# EAGLE design Groupe7 (EAGLE 9.6.2)
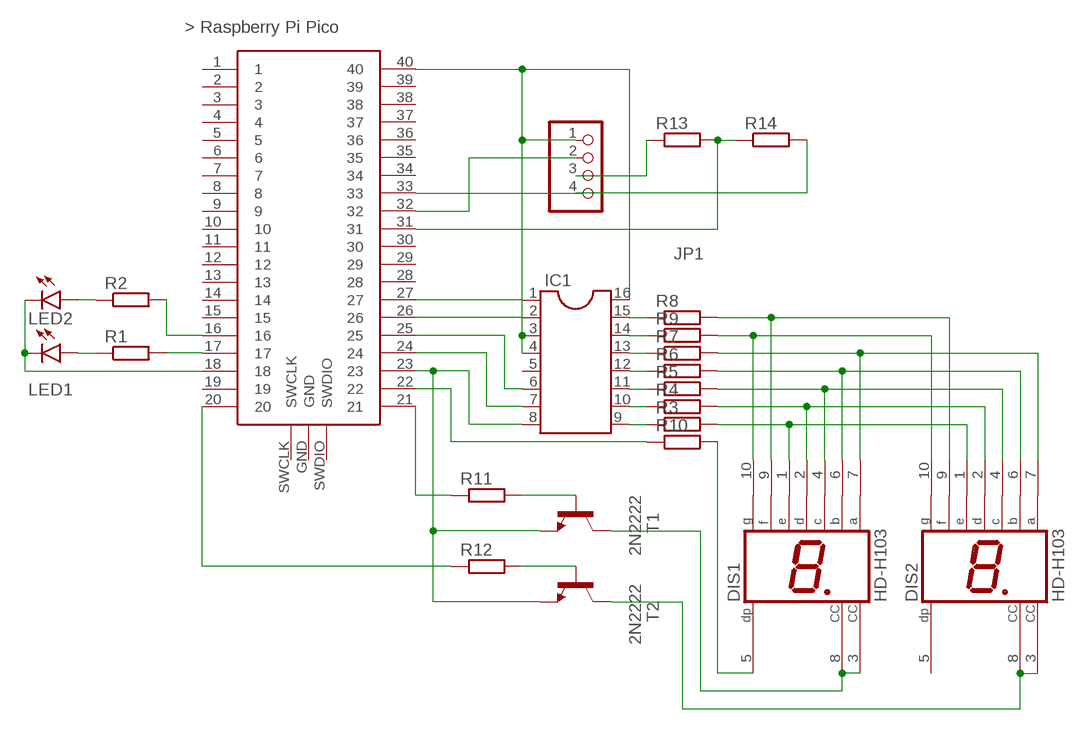
[diagram p0: schematic, sheet 1]

## Parts
DIS1  HD-H103  [HDSP-M]
DIS2  HD-H103  [HDSP-M]
IC1  DIL16  [DIL16]
JP1  PINHD-1X4  [1X04]
LED1  LED5MM  [LED5MM]
LED2  LED5MM  [LED5MM]
R1  R-EU_0207/7  [0207/7]
R2  R-EU_0207/7  [0207/7]
R3  R-EU_0207/7  [0207/7]
R4  R-EU_0207/7  [0207/7]
R5  R-EU_0207/7  [0207/7]
R6  R-EU_0207/7  [0207/7]
R7  R-EU_0207/7  [0207/7]
R8  R-EU_0207/7  [0207/7]
R9  R-EU_0207/7  [0207/7]
R10  R-EU_0207/7  [0207/7]
R11  R-EU_0207/7  [0207/7]
R12  R-EU_0207/7  [0207/7]
R13  R-EU_0207/7  [0207/7]
R14  R-EU_0207/7  [0207/7]
T1  2N2222  [TO18]
T2  2N2222  [TO18]
U$1  RASPBERRY-PI-PICO_TH  [FT_RASPBERRY-PI-PICO_TH]

## Nets
N$1: IC1.15 R8.1
N$2: IC1.14 R9.1
N$3: IC1.13 R7.1
N$4: IC1.12 R6.1
N$5: IC1.11 R5.1
N$6: IC1.10 R4.1
N$7: IC1.9 R3.1
N$8: IC1.1 U$1.27
N$9: IC1.2 U$1.26
N$10: IC1.6 U$1.25
N$11: IC1.7 U$1.24
N$12: DIS1.9(F) DIS2.9(F) R8.2
N$13: DIS1.10(G) DIS2.10(G) R9.2
N$14: DIS1.7(A) DIS2.7(A) R7.2
N$15: DIS1.6(B) DIS2.6(B) R6.2
N$16: DIS1.4(C) DIS2.4(C) R5.2
N$17: DIS1.2(D) DIS2.2(D) R4.2
N$18: DIS1.1(E) DIS2.1(E) R3.2
N$19: IC1.3 IC1.4 IC1.16 JP1.1 U$1.40
N$20: IC1.8 T1.1(E) T2.1(E) U$1.23
N$21: JP1.2 U$1.32
N$22: JP1.3 R13.1
N$23: JP1.4 R14.2 U$1.33
N$24: DIS1.3(CC) DIS1.8(CC) T1.3(C)
N$25: DIS2.3(CC) DIS2.8(CC) T2.3(C)
N$26: DIS1.5(DP) R10.2
N$27: R10.1 U$1.22
N$28: R12.1 U$1.20
N$29: R1.2 U$1.17
N$30: R11.1 U$1.21
N$31: R2.2 U$1.16
N$32: LED2.A R2.1
N$33: LED1.A R1.1
N$34: LED1.K(C) LED2.K(C) U$1.18
N$35: R11.2 T1.2(B)
N$36: R12.2 T2.2(B)
N$37: R13.2 R14.1 U$1.31
Unconnected: DIS2.5(DP) IC1.5 U$1.1 U$1.2 U$1.3 U$1.4 U$1.5 U$1.6 U$1.7 U$1.8 U$1.9 U$1.10 U$1.11 U$1.12 U$1.13 U$1.14 U$1.15 U$1.19 U$1.28 U$1.29 U$1.30 U$1.34 U$1.35 U$1.36 U$1.37 U$1.38 U$1.39 U$1.GND U$1.SWCLK U$1.SWDIO

## Library data of the parts
DIS1 DIS2 = display-hp:HD-H103: LED DISPLAY 1-character 7 segment, decimal point right; OC_FARNELL: unknown; OC_NEWARK: unknown
IC1 = ic-package:DIL16: Dual In Line / Socket
JP1 = pinhead:PINHD-1X4: PIN HEADER
LED1 LED2 = led:LED: LED OSRAM: - CHIPLED LG R971, LG N971, LY N971, LG Q971, LY Q971, LO R971, LY R971 LH N974, LH R974 LS Q976, LO Q976, LY Q976 LO Q996 - Hyper CHIPLED LW Q18S LB Q993, LB Q99A, LB R99A - SideLED LS A670, LO A670, LY A670, LG A670, LP A670 LB A673, LV A673, LT A673, LW A673 LH A674 LY A675 LS A676, LA A676, LO A676, LY A676, LW A676 LS A679, LY A679, LG A679 - Hyper Micro SIDELED® LS Y876, LA Y876, LO Y876, LY Y876 LT Y87S - SmartLED LW L88C, LW L88S LB L89C, LB L89S, LG L890 LS L89K, LO L89K, LY L89K LS L896, LA L896, LO L896, LY L896 - TOPLED LS T670, LO T670, LY T670, LG T670, LP T670 LSG T670, LSP T670, LSY T670, LOP T670, LYG T670 LG T671, LOG T671, LSG T671 LB T673, LV T673, LT T673, LW T673 LH T674 LS T676, LA T676, LO T676, LY T676, LB T676, LH T676, LSB T676, LW T676 LB T67C, LV T67C, LT T67C, LS T67K, LO T67K, LY T67K, LW E67C LS E67B, LA E67B, LO E67B, LY E67B, LB E67C, LV E67C, LT E67C LW T67C LS T679, LY T679, LG T679 LS T770, LO T770, LY T770, LG T770, LP T770 LB T773, LV T773, LT T773, LW T773 LH T774 LS E675, LA E675, LY E675, LS T675 LS T776, LA T776, LO T776, LY T776, LB T776 LHGB T686 LT T68C, LB T68C - Hyper Mini TOPLED® LB M676 - Mini TOPLED Santana® LG M470 LS M47K, LO M47K, LY M47K Source: http://www.osram.convergy.de LUXEON: - LUMILED® LXK2-PW12-R00, LXK2-PW12-S00, LXK2-PW14-U00, LXK2-PW14-V00 LXK2-PM12-R00, LXK2-PM12-S00, LXK2-PM14-U00 LXK2-PE12-Q00, LXK2-PE12-R00, LXK2-PE12-S00, LXK2-PE14-T00, LXK2-PE14-U00 LXK2-PB12-K00, LXK2-PB12-L00, LXK2-PB12-M00, LXK2-PB14-N00, LXK2-PB14-P00, LXK2-PB14-Q00 LXK2-PR12-L00, LXK2-PR12-M00, LXK2-PR14-Q00, LXK2-PR14-R00 LXK2-PD12-Q00, LXK2-PD12-R00, LXK2-PD12-S00 LXK2-PH12-R00, LXK2-PH12-S00 LXK2-PL12-P00, LXK2-PL12-Q00, LXK2-PL12-R00 Source: www.luxeon.com KINGBRIGHT: KA-3528ASYC Source: www.kingbright.com
R1-R14 = rcl:R-EU_: RESISTOR, European symbol; SPICEPREFIX: R
T1 T2 = transistor:2N2222: NPN TRANSISTOR
U$1 = pipico:RASPBERRY-PI-PICO_TH: Raspberry Pi Pico microcontroller board for through-hole mounting.

## Board
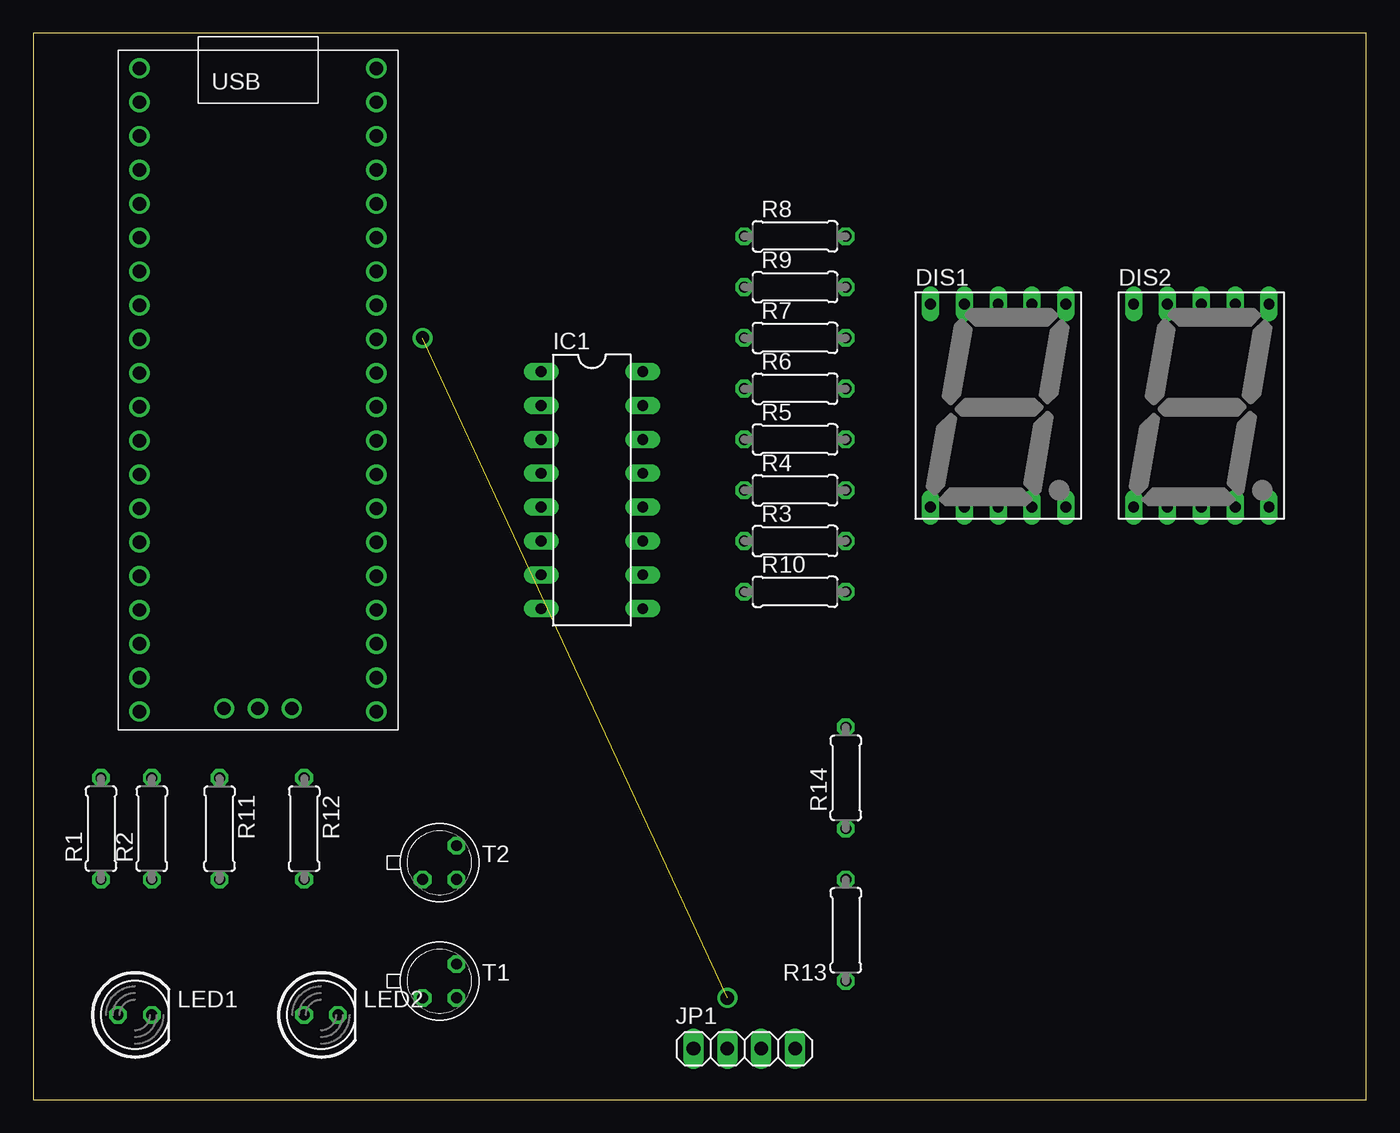
[diagram p1: board, top side]
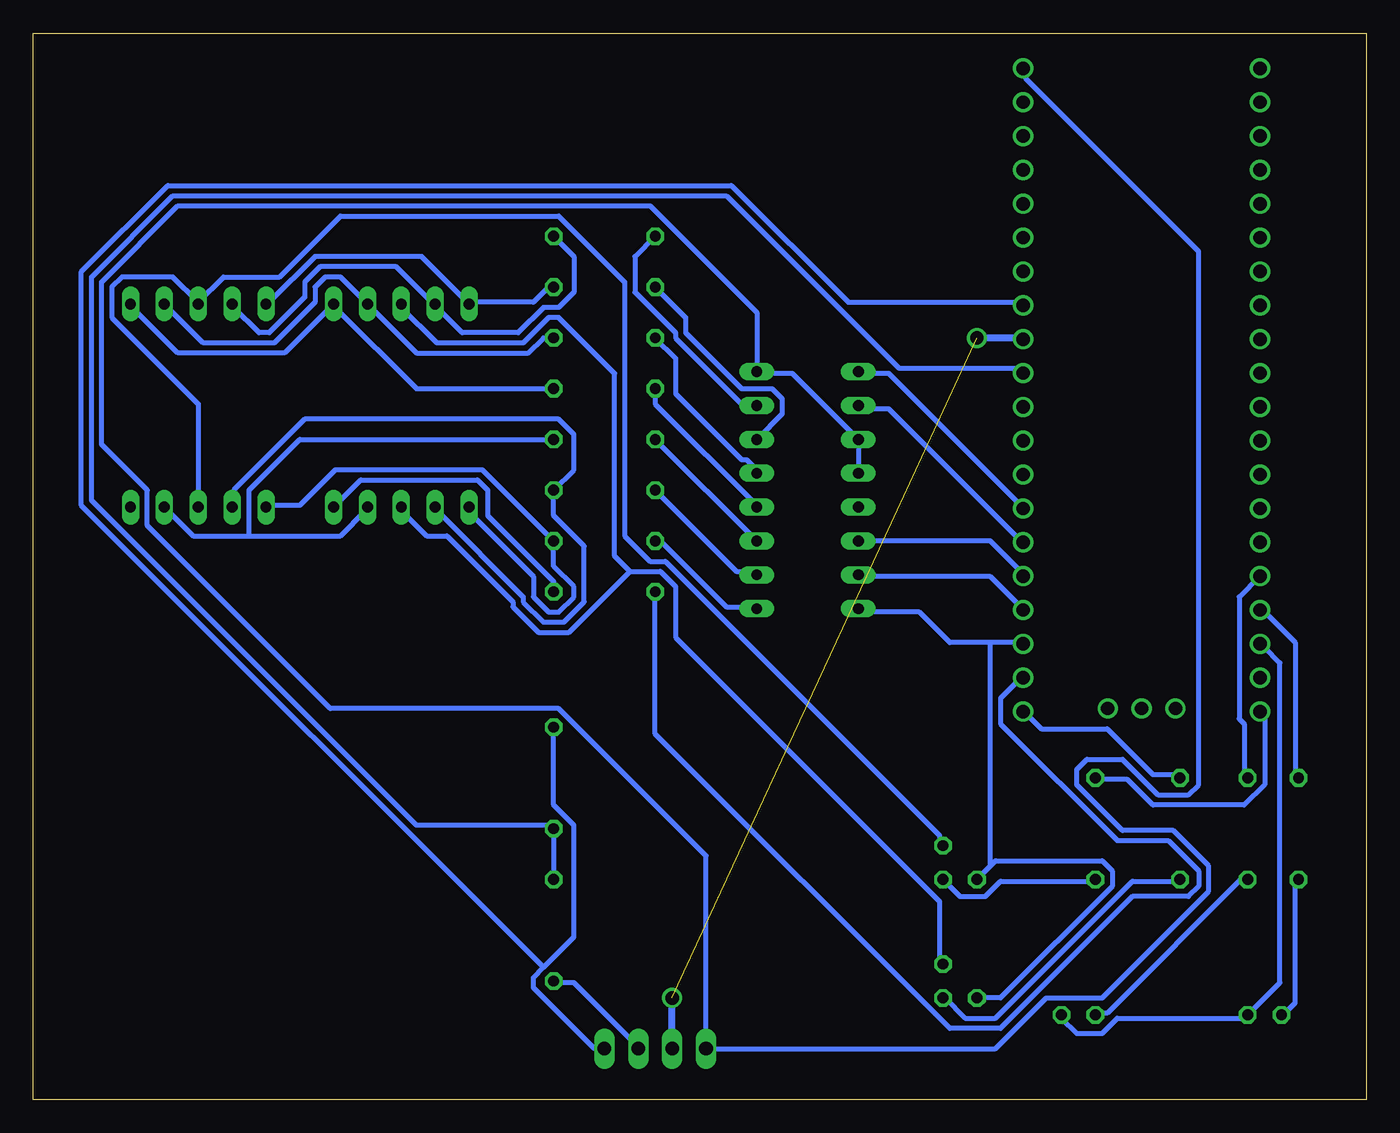
[diagram p2: board, bottom side, seen from below]

Size 100 x 80 mm. Coordinates in mm from the lower left corner, seen from the top.
Outline: 0,0 100,0 100,80 0,80 0,0
Copper layers (1*16): Top 0.035mm / dielectric 1.5mm / Bottom 0.035mm
Design rules "default *": minimum track width 15mil, minimum drill 0.35mm, track to track 15mil, track to pad 15mil, pad to pad 15mil, via to via 15mil, smd to smd 15mil, copper to edge 40mil, drill to drill 6mil, minimum pad ring 10mil, minimum via ring 8mil, stop-mask expansion 4mil, vias tented up to drill 0mil, thermal gap 10mil

### Footprints (pad centres in the part's own frame; a part is rotated, then mirrored left to right if it is on the bottom)
HDSP-M = drill 0.813 long: 1 -5.08,-7.62; 2 -2.54,-7.62; 3 0,-7.62; 4 2.54,-7.62; 5 5.08,-7.62; 6 5.08,7.62; 7 2.54,7.62; 8 0,7.62; 9 -2.54,7.62; 10 -5.08,7.62
DIL16 = drill 0.813 long: 1 -8.89,-3.81; 2 -6.35,-3.81; 3 -3.81,-3.81; 4 -1.27,-3.81; 5 1.27,-3.81; 6 3.81,-3.81; 7 6.35,-3.81; 8 8.89,-3.81; 9 8.89,3.81; 10 6.35,3.81; 11 3.81,3.81; 12 1.27,3.81; 13 -1.27,3.81; 14 -3.81,3.81; 15 -6.35,3.81; 16 -8.89,3.81
1X04 = drill 1.016 long: 1 -3.81,0; 2 -1.27,0; 3 1.27,0; 4 3.81,0
LED5MM = drill 0.813 octagon: A -1.27,0; K 1.27,0
0207/7 = drill 0.813 octagon: 1 -3.81,0; 2 3.81,0
TO18 = drill 0.813 octagon: 1 -1.27,-1.27; 2 1.27,-1.27; 3 1.27,1.27
FT_RASPBERRY-PI-PICO_TH = drill 1: 1 -8.55,24.03; 2 -8.55,21.49; 3 -8.55,18.95; 4 -8.55,16.41; 5 -8.55,13.87; 6 -8.55,11.33; 7 -8.55,8.79; 8 -8.55,6.25; 9 -8.55,3.71; 10 -8.55,1.17; 11 -8.55,-1.37; 12 -8.55,-3.91; 13 -8.55,-6.45; 14 -8.55,-8.99; 15 -8.55,-11.53; 16 -8.55,-14.07; 17 -8.55,-16.61; 18 -8.55,-19.15; 19 -8.55,-21.69; 20 -8.55,-24.23; 21 9.23,-24.23; 22 9.23,-21.69; 23 9.23,-19.15; 24 9.23,-16.61; 25 9.23,-14.07; 26 9.23,-11.53; 27 9.23,-8.99; 28 9.23,-6.45; 29 9.23,-3.91; 30 9.23,-1.37; 31 9.23,1.17; 32 9.23,3.71; 33 9.23,6.25; 34 9.23,8.79; 35 9.23,11.33; 36 9.23,13.87; 37 9.23,16.41; 38 9.23,18.95; 39 9.23,21.49; 40 9.23,24.03; GND 0.34,-24; SWCLK -2.2,-24; SWDIO 2.88,-24

### Placement (x,y rotation side)
DIS1  72.39,52.07 0 top
DIS2  87.63,52.07 0 top
IC1  41.91,45.72 270 top
JP1  53.34,3.81 0 top
LED1  7.62,6.35 0 top
LED2  21.59,6.35 0 top
R1  5.08,20.32 90 top
R2  8.89,20.32 90 top
R3  57.15,41.91 0 top
R4  57.15,45.72 0 top
R5  57.15,49.53 0 top
R6  57.15,53.34 0 top
R7  57.15,57.15 0 top
R8  57.15,64.77 0 top
R9  57.15,60.96 0 top
R10  57.15,38.1 0 top
R11  13.97,20.32 270 top
R12  20.32,20.32 270 top
R13  60.96,12.7 90 top
R14  60.96,24.13 90 top
T1  30.48,8.89 0 top
T2  30.48,17.78 0 top
U$1  16.51,53.34 0 top

### Tracks (layer width: path | path; a pad name or v marks a point on that pad's centre or on a via)
N$1
  Bottom 0.381: R8.1 54.86,63.25 54.86,60.58 51.82,57.53 51.82,57.15 46.86,52.2 45.72,52.2 IC1.15
N$2
  Bottom 0.381: IC1.14 43.81,51.44 43.81,52.58 44.58,53.34 46.86,53.34 51.05,57.53 51.05,58.67 R9.1
N$3
  Bottom 0.381: R7.1 51.82,55.63 51.82,52.96 46.86,48.01 46.48,48.01 45.72,47.24 IC1.13
N$4
  Bottom 0.381: R6.1 53.34,52.2 45.72,44.58 IC1.12
N$5
  Bottom 0.381: R5.1 IC1.11
N$6
  Bottom 0.381: R4.1 47.24,39.62 45.72,39.62 IC1.10
N$7
  Bottom 0.381: R3.1 52.96,41.91 48.01,36.96 45.72,36.96 IC1.9
N$8
  Bottom 0.381: IC1.1 38.1,54.48 35.81,54.48 25.91,44.58 U$1.27
N$9
  Bottom 0.381: IC1.2 38.1,51.82 35.81,51.82 25.91,41.91 U$1.26
N$10
  Bottom 0.381: IC1.6 28.19,41.91 25.91,39.62 U$1.25
N$11
  Bottom 0.381: IC1.7 38.1,39.24 28.19,39.24 25.91,36.96 U$1.24
N$12
  Bottom 0.381: R8.2 59.44,63.25 59.44,60.58 60.58,59.44 61.72,59.44 63.63,57.53 67.82,57.53 69.72,59.44 DIS1.9 70.1,59.82 72.77,62.48 78.49,62.48 79.63,61.34 79.63,60.2 82.3,57.53 83.06,57.53 84.96,59.44 DIS2.9
N$13
  Bottom 0.381: R9.2 61.34,60.96 62.48,59.82 67.06,59.82 DIS1.10 70.87,63.25 78.87,63.25 82.3,59.82 DIS2.10
N$14
  Bottom 0.381: R7.2 61.72,57.15 62.87,56.01 71.25,56.01 DIS1.7 76.96,61.72 78.11,61.72 78.87,60.96 78.87,59.82 81.92,56.77 87.25,56.77 DIS2.7
N$15
  Bottom 0.381: R6.2 71.25,53.34 77.34,59.44 DIS1.6 81.15,56.01 89.15,56.01 92.58,59.44 DIS2.6
N$16
  Bottom 0.381: 83.82,42.29 88.01,42.29 DIS2.4 | 83.82,42.29 76.96,42.29 75.06,44.2 DIS1.4 | R5.2 80.01,49.53 83.82,45.72 83.82,42.29
N$17
  Bottom 0.381: DIS1.2 69.72,44.2 63.25,37.72 63.25,37.34 61.72,35.81 60.2,35.81 58.67,37.34 58.67,41.53 60.96,43.81 R4.2 59.44,47.24 59.44,49.91 60.58,51.05 79.63,51.05 84.96,45.72 84.96,44.58 DIS2.2
N$18
  Bottom 0.381: DIS1.1 67.44,44.2 62.48,39.24 62.48,37.72 61.34,36.58 60.58,36.58 59.44,37.72 59.44,38.48 60.96,40.01 R3.2 66.29,47.24 77.34,47.24 80.01,44.58 82.3,44.58 DIS2.1
N$19
  Bottom 0.381: IC1.4 IC1.3 43.05,54.48 45.72,54.48 IC1.16 45.72,59.05 53.72,67.06 89.15,67.06 94.87,61.34 94.87,49.15 91.44,45.72 91.44,43.05 77.72,29.34 60.58,29.34 49.53,18.29 JP1.1 27.81,3.81 24,7.62 19.81,7.62 11.81,15.62 11.81,17.53 14.48,20.19 18.29,20.19 21.72,23.62 21.72,24.77 20.95,25.53 18.29,25.53 15.62,22.86 13.34,22.86 12.57,23.62 12.57,63.63 25.53,76.58 25.53,77.34 U$1.40
N$20
  Bottom 0.381: 28.19,34.29 25.91,34.29 U$1.23 | 28.19,34.29 31.24,34.29 33.53,36.58 38.1,36.58 IC1.8 | T1.1 27.43,7.62 19.05,16 19.05,17.14 19.81,17.91 27.81,17.91 28.19,17.53 | T2.1 28.19,17.53 | 28.19,17.53 28.19,34.29
N$21  (1 unrouted)
  Bottom 0.508: U$1.32 25.84,57.15 29.21,57.15 | JP1.2 52.07,7.62
N$22
  Bottom 0.381: R13.1 60.96,8.76 59.44,8.76 54.48,3.81 JP1.3
N$23
  Bottom 0.381: R14.2 60.96,22.1 59.44,20.57 59.44,12.19 61.72,9.91 | 61.72,9.91 62.48,9.14 62.48,8.38 57.91,3.81 JP1.4 | 61.72,9.91 96.39,44.58 96.39,62.1 89.92,68.58 47.62,68.58 38.86,59.82 25.91,59.82 U$1.33
N$24
  Bottom 0.381: 55.24,39.62 52.96,39.62 51.82,38.48 51.82,34.67 32,14.86 32,10.29 T1.3 | 55.24,39.62 59.82,35.05 62.1,35.05 64.01,36.96 64.01,37.34 68.96,42.29 70.48,42.29 72.39,44.2 DIS1.3 | 55.24,39.62 56.39,40.77 56.39,54.48 60.58,58.67 61.34,58.67 63.25,56.77 69.72,56.77 72.39,59.44 DIS1.8
N$25
  Bottom 0.381: 87.63,59.82 85.72,61.72 81.53,61.72 76.96,66.29 60.58,66.29 55.63,61.34 55.63,42.29 53.72,40.39 52.58,40.39 32,19.81 32,19.05 T2.3 | DIS2.3 87.63,52.2 94.11,58.67 94.11,60.96 93.34,61.72 89.53,61.72 87.63,59.82 | 87.63,59.82 DIS2.8
N$26
  Bottom 0.381: R10.2 60.96,38.86 65.91,43.81 65.91,45.72 66.67,46.48 75.44,46.48 DIS1.5
N$27
  Bottom 0.381: R10.1 53.34,27.43 31.24,5.33 27.43,5.33 17.53,15.24 13.34,15.24 12.57,16 12.57,17.14 14.86,19.43 18.67,19.43 27.43,28.19 27.43,30.1 25.91,31.62 U$1.22
N$28
  Bottom 0.381: R12.1 20.19,24 17.91,24 16,22.1 9.14,22.1 7.62,23.62 7.62,28.96 U$1.20
N$29
  Bottom 0.381: R1.2 5.33,24.38 5.33,34.29 7.62,36.58 U$1.17
N$30
  Bottom 0.381: R11.1 14.1,24.38 16,24.38 19.43,27.81 24.38,27.81 25.53,28.96 U$1.21
N$31
  Bottom 0.381: R2.2 9.14,24.38 9.14,28.19 9.53,28.57 9.53,37.72 8,39.24 U$1.16
N$32
  Bottom 0.381: LED2.A 20.19,6.48 19.43,6.48 9.14,16.76 R2.1
N$33
  Bottom 0.381: R1.1 5.33,16.38 5.33,7.24 6.1,6.48 LED1.A
N$34
  Bottom 0.381: LED2.K 22.86,6.1 21.72,4.95 19.81,4.95 18.67,6.1 9.14,6.1 LED1.K 6.48,8.76 6.48,32.77 7.62,33.91 U$1.18
N$35
  Bottom 0.381: R11.2 14.1,16.38 17.53,16.38 27.81,6.1 30.1,6.1 31.62,7.62 T1.2
N$36
  Bottom 0.381: T2.2 30.48,15.24 28.57,15.24 27.43,16.38 20.57,16.38 R12.2
N$37
  Bottom 0.381: R13.2 R14.1 60.96,20.57 71.25,20.57 95.63,44.96 95.63,61.72 89.53,67.82 48.01,67.82 35.05,54.86 25.91,54.86 U$1.31
N$38  (via drill 1 pad 1.3)
  other vias: 52.07,7.62
N$39  (via drill 1 pad 1.3)
  other vias: 29.21,57.15